# EAGLE design msp430_round (EAGLE 6.5.0)
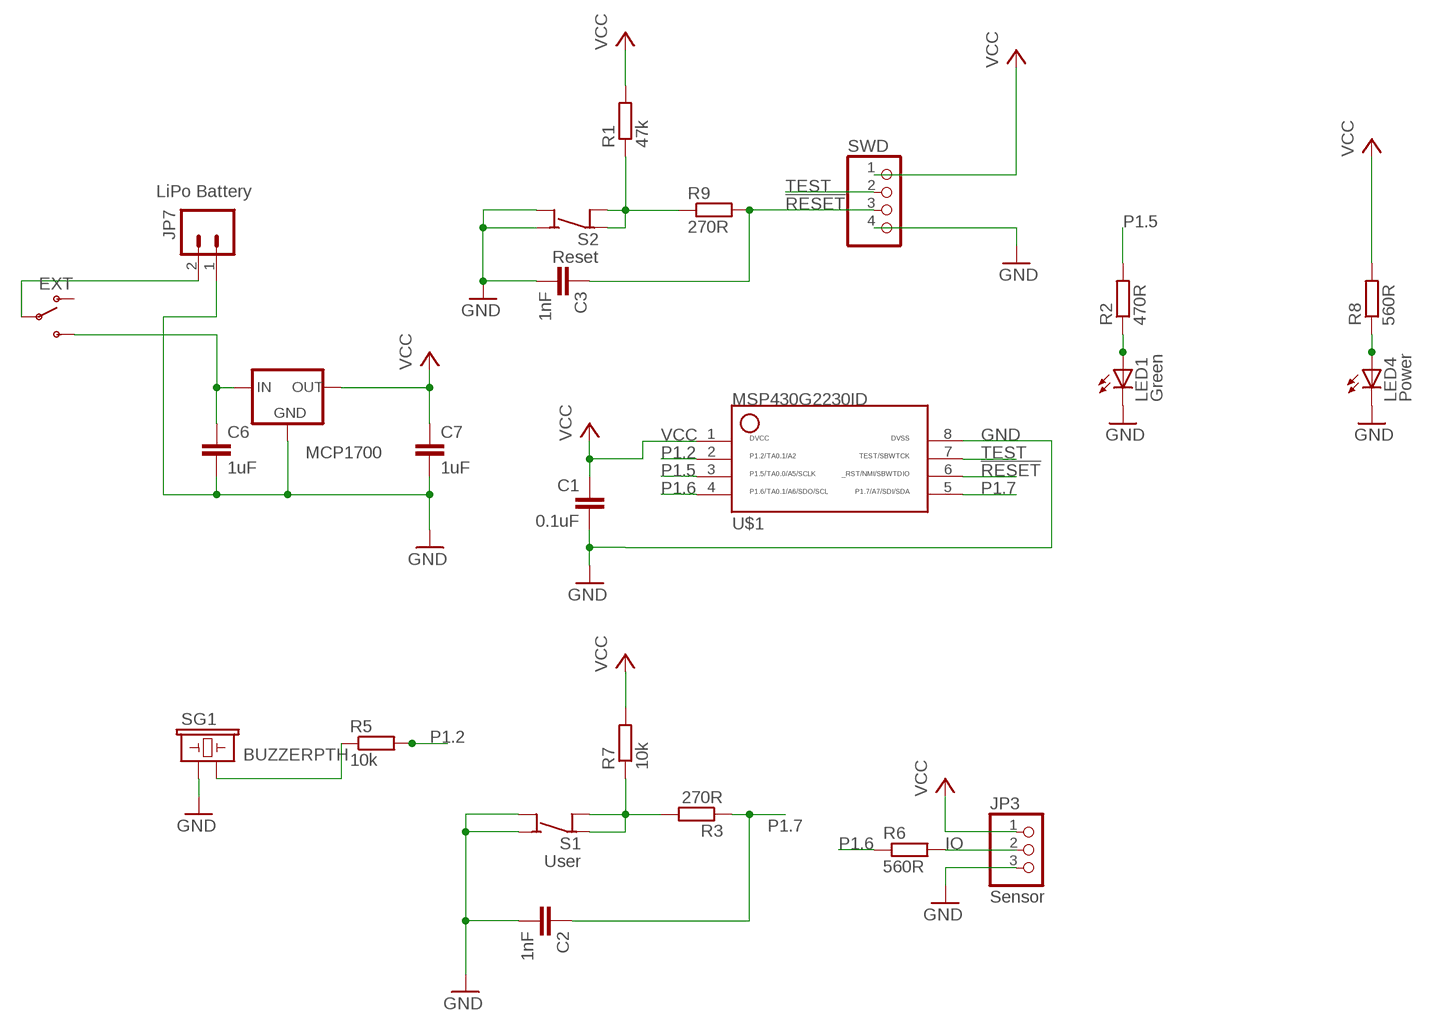
[diagram p0: schematic, sheet 1]

## Parts
C1  0.1uF  C-EUC0805  [C0805]
C2  1nF  C-EUC0805  [C0805]
C3  1nF  C-EUC0805  [C0805]
C6  1uF  C-EUC0805  [C0805]
C7  1uF  C-EUC0805  [C0805]
JP3  Sensor  PINHD-1X3  [1X03]
JP7  LiPo Battery  M02JST-PTH-2  [JST-2-PTH]
LED1  Green  LEDCHIPLED_1206  [CHIPLED_1206]
LED4  Power  LEDCHIPLED_1206  [CHIPLED_1206]
MCP1700  MCP1700  MCP1700SOT-23  [SOT-23]
ON  EXT  SWITCH-SPSTPTH  [SWITCH-SPDT]
R1  47k  R-EU_R0805  [R0805]
R2  470R  R-EU_R0805  [R0805]
R3  270R  R-EU_R0805  [R0805]
R5  10k  R-EU_R0805  [R0805]
R6  560R  R-EU_R0805  [R0805]
R7  10k  R-EU_R0805  [R0805]
R8  560R  R-EU_R0805  [R0805]
R9  270R  R-EU_R0805  [R0805]
S1  User  SPST4  [6MMTACTILE_4PIN]
S2  Reset  SPST4  [6MMTACTILE_4PIN]
SG1  BUZZERPTH  [BUZZER-12MM]
SWD  PINHD-1X4  [1X04]
U$1  MSP430G2230ID  [SO08]

## Nets
!RESET: C3.1 R9.2 SWD.3 U$1.6
GND [GND]: C1.2 C2.2 C3.2 C6.2 C7.2 JP3.3 JP7.1 LED1.C LED4.C MCP1700.1(GND) S1.A1(NO) S1.A2(NO) S2.A1(NO) S2.A2(NO) SG1.+ SWD.4 U$1.8
IO: JP3.2 R6.2
N$2: LED4.A R8.1
N$3 [VCC]: JP7.2 ON.2(P)
N$4: LED1.A R2.1
N$5: R1.1 R9.1 S2.B1(COM) S2.B2(COM)
N$6: R5.1 SG1.-
N$7: R3.2 R7.1 S1.B1(COM) S1.B2(COM)
N$15 [VCC]: C6.1 MCP1700.3(IN) ON.3(S)
P1.2: R5.2 U$1.2
P1.5: R2.2 U$1.3
P1.6: R6.1 U$1.4
P1.7: C2.1 R3.1 U$1.5
TEST: SWD.2 U$1.7
VCC [VCC]: C1.1 C7.1 JP3.1 MCP1700.2(OUT) R1.2 R7.2 R8.2 SWD.1 U$1.1
Unconnected: ON.1(O)

## Library data of the parts
C1-C3 C6 C7 = resistor:C-EU: CAPACITOR, European symbol
JP3 = pinhead:PINHD-1X3: PIN HEADER
JP7 = SparkFun:M02: Header 2 Standard 2-pin 0.1" header. Use with straight break away headers (SKU : PRT-00116), right angle break away headers (PRT-00553), swiss pins (PRT-00743), machine pins (PRT-00117), and female headers (PRT-00115). Molex polarized connector foot print use with SKU : PRT-08233 with associated crimp pins and housings.
LED1 LED4 = adafruit:LED: LED OSRAM: - CHIPLED LG R971, LG N971, LY N971, LG Q971, LY Q971, LO R971, LY R971 LH N974, LH R974 LS Q976, LO Q976, LY Q976 LO Q996 - Hyper CHIPLED LW Q18S LB Q993, LB Q99A, LB R99A - SideLED LS A670, LO A670, LY A670, LG A670, LP A670 LB A673, LV A673, LT A673, LW A673 LH A674 LY A675 LS A676, LA A676, LO A676, LY A676, LW A676 LS A679, LY A679, LG A679 - Hyper Micro SIDELED® LS Y876, LA Y876, LO Y876, LY Y876 LT Y87S - SmartLED LW L88C, LW L88S LB L89C, LB L89S, LG L890 LS L89K, LO L89K, LY L89K LS L896, LA L896, LO L896, LY L896 - TOPLED LS T670, LO T670, LY T670, LG T670, LP T670 LSG T670, LSP T670, LSY T670, LOP T670, LYG T670 LG T671, LOG T671, LSG T671 LB T673, LV T673, LT T673, LW T673 LH T674 LS T676, LA T676, LO T676, LY T676, LB T676, LH T676, LSB T676, LW T676 LB T67C, LV T67C, LT T67C, LS T67K, LO T67K, LY T67K, LW E67C LS E67B, LA E67B, LO E67B, LY E67B, LB E67C, LV E67C, LT E67C LW T67C LS T679, LY T679, LG T679 LS T770, LO T770, LY T770, LG T770, LP T770 LB T773, LV T773, LT T773, LW T773 LH T774 LS E675, LA E675, LY E675, LS T675 LS T776, LA T776, LO T776, LY T776, LB T776 LHGB T686 LT T68C, LB T68C - Hyper Mini TOPLED® LB M676 - Mini TOPLED Santana® LG M470 LS M47K, LO M47K, LY M47K Source: http://www.osram.convergy.de/
MCP1700 = MY_IC:MCP1700
ON = SparkFun:SWITCH-SPST: SPST Switch Simple slide switch. Spark Fun Electronics SKU : COM-00102
R1-R3 R5-R9 = resistor:R-EU_: RESISTOR, European symbol
S1 S2 = mes_electromech:SPST4: SPST switch with 2 pins per contact
SG1 = SparkFun:BUZZER: Buzzer 12mm Spark Fun Electronics SKU : Comp-Buzzer
SWD = pinhead:PINHD-1X4: PIN HEADER
U$1 = thierry_eagle:MSP430G2230ID

## Net classes
0 default: width 0.305 mm, drill 0.508 mm
1 GND: width 0.508 mm, drill 0.508 mm
2 VCC: width 0.508 mm, drill 0.508 mm

## Board
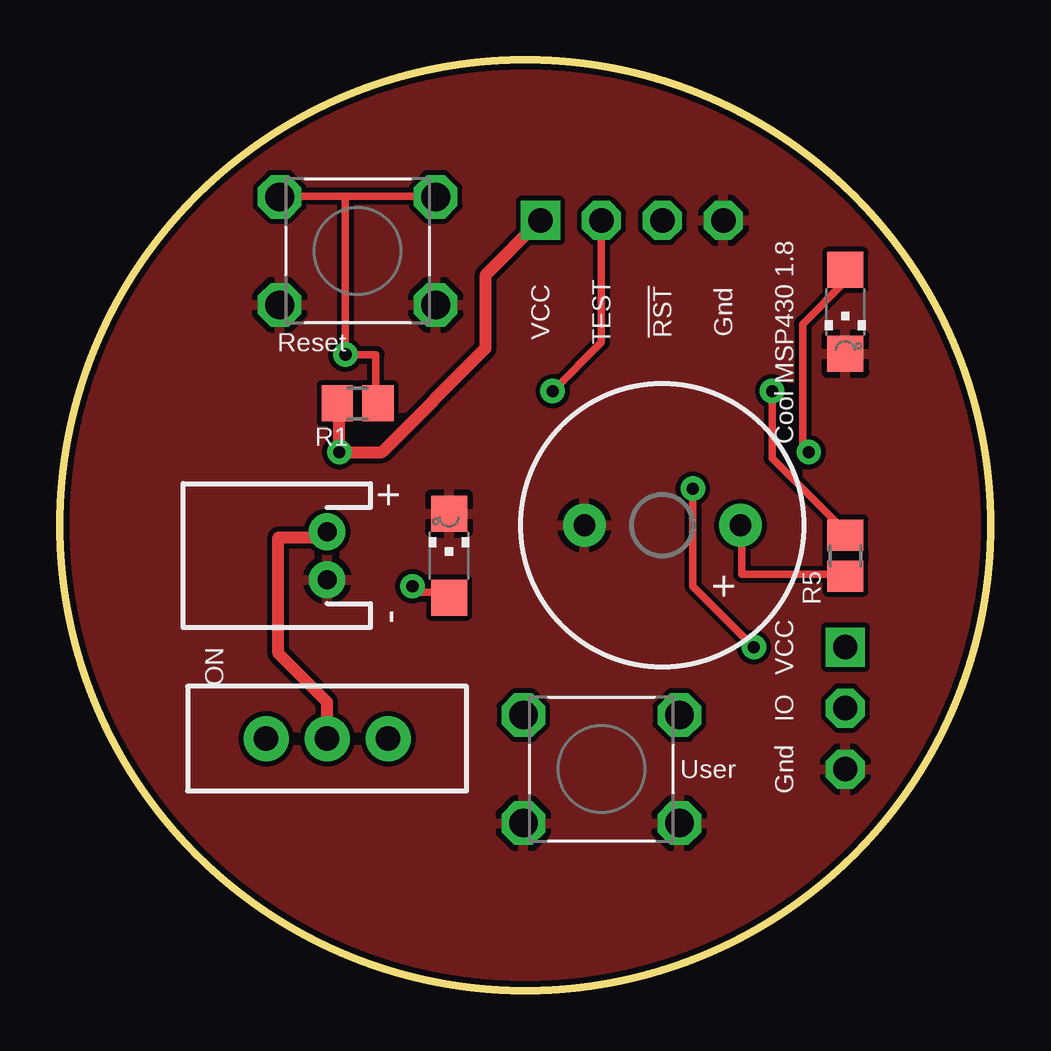
[diagram p1: board, top side]
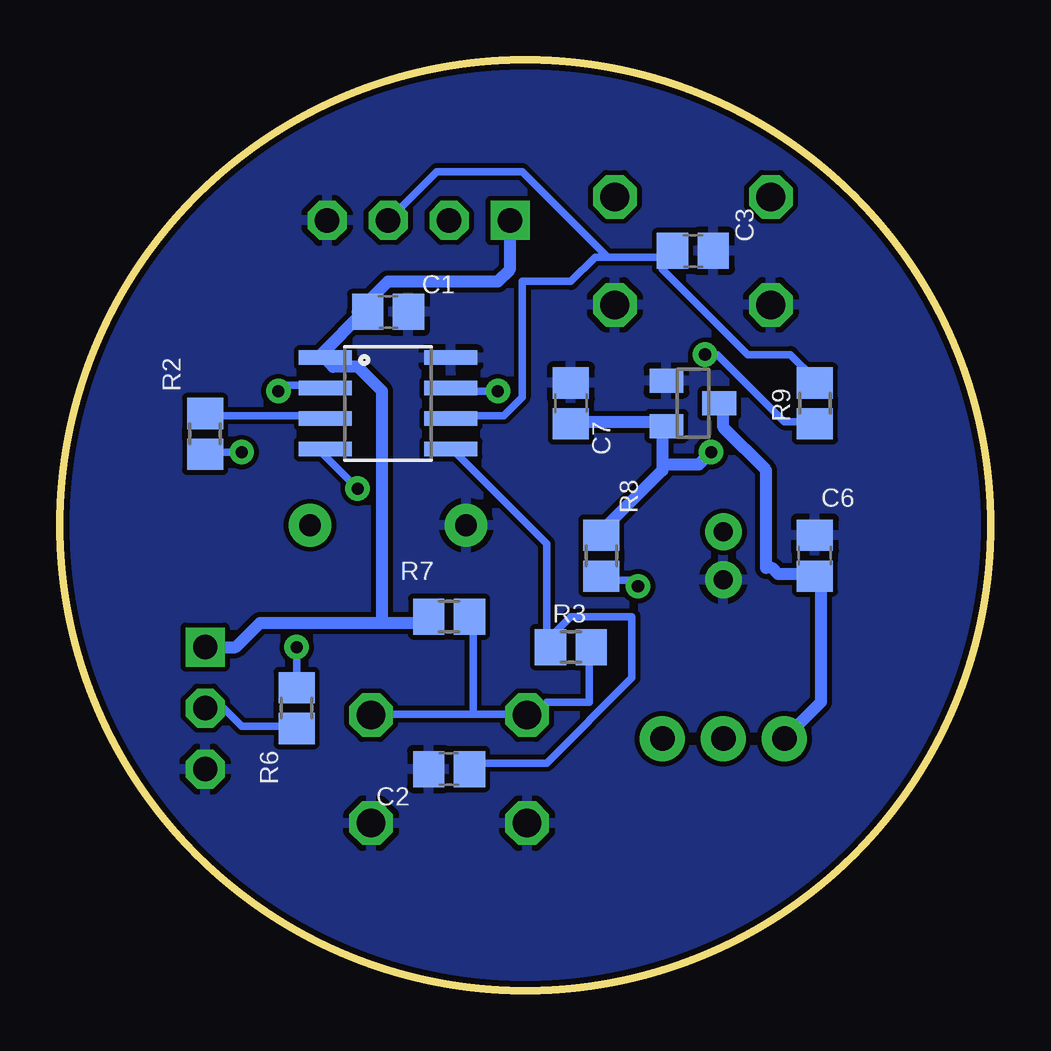
[diagram p2: board, bottom side, seen from below]

Size 38.77 x 38.77 mm. Coordinates in mm from the lower left corner, seen from the top.
Outline: circle at 19.39,19.39 radius 19.39
Copper layers (1*16): Top 0.035mm / dielectric 1.5mm / Bottom 0.035mm
Design rules "SparkFun *": minimum track width 12mil, minimum drill 20mil, track to track 8mil, track to pad 8mil, pad to pad 8mil, via to via 8mil, smd to smd 8mil, copper to edge 10mil, drill to drill 8mil, minimum pad ring 12mil, minimum via ring 10mil, stop-mask expansion 4mil, vias tented up to drill 25mil, thermal gap 10mil

### Footprints (pad centres in the part's own frame; a part is rotated, then mirrored left to right if it is on the bottom)
C0805 = smd 1.3 x 1.5: 1 -0.85,0; 2 0.85,0
1X03 = drill 1.016 square: 1 -2.54,0 | drill 1.016 octagon: 2 0,0; 3 2.54,0
JST-2-PTH = drill 0.787 pad 1.524: 1 -1,0; 2 1,0
CHIPLED_1206 = smd 1.5 x 1.5: A 0,-1.75; C 0,1.75
SOT-23 = smd 1 x 1.4: 1 -0.95,-1.1; 2 0.95,-1.1; 3 0,1.1
SWITCH-SPDT = drill 1.016 pad 1.88: 1 0,2.54; 2 0,0; 3 0,-2.54
R0805 = smd 1.3 x 1.5: 1 -0.85,0; 2 0.85,0
6MMTACTILE_4PIN = drill 1.2 octagon: A1 3.25,-2.25; A2 -3.25,-2.25; B1 3.25,2.25; B2 -3.25,2.25
BUZZER-12MM = drill 0.9 pad 1.778: + 3.25,0; - -3.25,0
1X04 = drill 1.016 square: 1 -3.81,0 | drill 1.016 octagon: 2 -1.27,0; 3 1.27,0; 4 3.81,0
SO08 = smd 0.61 x 2.21: 1 -1.905,-2.616; 2 -0.635,-2.616; 3 0.635,-2.616; 4 1.905,-2.616; 5 1.905,2.616; 6 0.635,2.616; 7 -0.635,2.616; 8 -1.905,2.616

### Placement (x,y rotation side)
C1  25.1,28.28 0 bottom
C2  22.56,9.23 180 bottom
C3  12.4,30.82 0 bottom
C6  7.32,18.12 90 bottom
C7  17.48,24.47 90 bottom
JP3  32.72,11.77 270 top
JP7  11.13,18.12 90 top
LED1  32.72,28.28 180 top
LED4  16.21,18.12 0 top
MCP1700  12.4,24.47 270 bottom
ON  11.13,10.5 270 top
R1  12.4,24.47 180 top
R2  32.72,23.2 90 bottom
R3  17.48,14.31 0 bottom
R5  32.72,18.12 90 top
R6  28.91,11.77 270 bottom
R7  22.56,15.58 180 bottom
R8  16.21,18.12 90 bottom
R9  7.32,24.47 90 bottom
S1  22.56,9.23 0 top
S2  12.4,30.82 0 top
SG1  25.1,19.39 180 top
SWD  23.83,32.09 0 top
U$1  25.1,24.47 270 bottom

### Tracks (layer width: path | path; a pad name or v marks a point on that pad's centre or on a via)
!RESET
  Bottom 0.305: 13.67,30.56 13.67,30.82 C3.1 13.67,30.56 | 13.67,30.56 13.67,30.05 10.11,26.5 8.34,26.5 7.32,25.48 R9.2 | 13.67,30.56 15.96,30.56 | 15.96,30.56 16.46,30.56 17.48,29.55 19.51,29.55 19.51,24.72 20.27,23.96 22.31,23.96 U$1.6 | SWD.3 23.07,34.12 19.51,34.12 15.96,30.56
GND
  pour Bottom: -0.93,40.98 40.34,40.98 40.34,-0.93 -0.93,-0.93
  pour Top: -0.93,40.98 40.34,40.98 40.34,-0.93 -0.93,-0.93
IO
  Bottom 0.305: JP3.2 31.96,11.77 31.2,11 28.91,11 R6.2
N$2  (via drill 0.51)
  Top 0.305: v14.69,16.85 14.69,16.59 16.21,16.59 LED4.A
  Bottom 0.305: v14.69,16.85 14.94,17.1 16.21,17.1 R8.1
N$3
  Top 0.508: ON.2 11.13,12.02 9.1,14.05 9.1,18.88 11.13,18.88 JP7.2
N$4  (via drill 0.51)
  Top 0.305: v31.2,22.43 30.94,22.69 30.94,27.77 32.72,29.55 LED1.A
  Bottom 0.305: v31.2,22.43 32.72,22.43 R2.1
N$5  (via drill 0.51)
  Top 0.305: R1.1 13.16,24.47 13.16,26.5 v11.89,26.5 11.89,33.1 | 11.89,33.1 15.45,33.1 S2.B1 | 11.89,33.1 9.35,33.1 S2.B2
  Bottom 0.305: v11.89,26.5 11.38,26.5 8.59,23.7 7.32,23.7 R9.1
N$6
  Top 0.305: R5.1 32.72,17.35 28.4,17.35 28.4,19.39 SG1.-
N$7
  Bottom 0.305: R3.2 16.72,14.31 16.72,12.02 18.5,12.02 19,11.51 19.26,11.51 S1.B2 19.51,11.51 21.54,11.51 | 21.54,11.51 21.54,15.58 R7.1 | 21.54,11.51 25.61,11.51 S1.B1
N$15
  Bottom 0.508: MCP1700.3 11.13,24.47 11.13,23.45 9.35,21.67 9.35,17.61 9.1,17.61 8.84,17.35 7.32,17.35 C6.1 7.32,17.1 7.07,17.1 7.07,12.02 ON.3
P1.2  (via drill 0.51)
  Top 0.305: v29.67,24.97 29.67,22.18 32.72,19.13 R5.2
  Bottom 0.305: v29.67,24.97 29.42,25.23 27.89,25.23 U$1.2
P1.5
  Bottom 0.305: R2.2 32.72,23.96 27.89,23.96 U$1.3
P1.6  (via drill 0.51)
  Top 0.305: v28.91,14.31 26.37,16.85 v26.37,20.91
  Bottom 0.305: v28.91,14.31 R6.1 | v26.37,20.91 27.89,22.43 U$1.4
P1.7
  Bottom 0.305: 18.24,14.81 17.48,15.58 14.94,15.58 14.94,13.04 18.5,9.48 21.29,9.48 21.54,9.23 C2.1 | 18.24,14.81 18.24,14.31 R3.1 18.24,14.81 | 18.24,14.81 18.5,14.81 18.5,18.62 22.31,22.43 U$1.5
TEST  (via drill 0.51)
  Top 0.305: v20.53,24.97 22.56,27.01 SWD.2
  Bottom 0.305: v20.53,24.97 22.31,24.97 U$1.7
VCC  (via drill 0.51)
  Top 0.508: R1.2 11.64,24.47 v11.64,22.43 13.42,22.43 17.73,26.75 17.73,29.8 SWD.1
  Bottom 0.508: C7.1 17.48,23.7 13.67,23.7 MCP1700.2 13.67,23.45 13.67,21.93 | 13.67,21.93 13.67,21.67 16.21,19.13 R8.2 | v11.64,22.43 12.15,21.93 13.67,21.93 | 25.35,15.32 30.43,15.32 31.45,14.31 JP3.1 | 25.35,15.32 23.83,15.32 23.58,15.58 R7.2 | 25.35,15.32 25.35,24.97 26.37,25.99 27.39,25.99 27.64,26.24 U$1.1 27.89,26.5 26.12,28.28 C1.1 26.37,28.28 25.1,29.55 20.53,29.55 20.02,30.05 SWD.1

### Text on the board
tNames: VCC | TEST | !RST | Gnd | Cool MSP430 1.8 | + | + | - | VCC | IO | Gnd